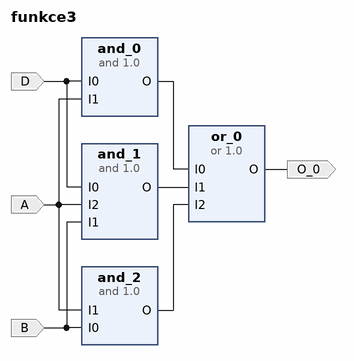
[diagram p0: block diagram of the top level]
# Vivado block design funkce3, xc7a35tcpg236-1, Vivado 2018.2.1
create_bd_design funkce3

create_bd_port -dir I -type data D
create_bd_port -dir I -type data B
create_bd_port -dir I -type data A
create_bd_port -dir O -type data O_0

create_bd_cell -type ip -vlnv FIT:user:and:1.0 and_0
set_property -dict {CONFIG.I0_Inverted true CONFIG.I1_inverted true} [get_bd_cells and_0]
create_bd_cell -type ip -vlnv FIT:user:and:1.0 and_1
set_property -dict {CONFIG.Inputs 3 CONFIG.I1_inverted true} [get_bd_cells and_1]
create_bd_cell -type ip -vlnv FIT:user:and:1.0 and_2
set_property -dict {CONFIG.I1_inverted true} [get_bd_cells and_2]
create_bd_cell -type ip -vlnv FIT:user:or:1.0 or_0
set_property -dict {CONFIG.Inputs 3} [get_bd_cells or_0]

# ---- connections ----

connect_bd_net [get_bd_ports A] [get_bd_pins and_0/I1] [get_bd_pins and_1/I2] [get_bd_pins and_2/I1]
connect_bd_net [get_bd_ports D] [get_bd_pins and_0/I0] [get_bd_pins and_1/I0]
connect_bd_net [get_bd_ports B] [get_bd_pins and_1/I1] [get_bd_pins and_2/I0]
connect_bd_net [get_bd_pins and_0/O] [get_bd_pins or_0/I0]
connect_bd_net [get_bd_pins and_1/O] [get_bd_pins or_0/I1]
connect_bd_net [get_bd_pins and_2/O] [get_bd_pins or_0/I2]
connect_bd_net [get_bd_pins or_0/O] [get_bd_ports O_0]

validate_bd_design
save_bd_design
